# EAGLE schematic ME433 (EAGLE 9.3.0)
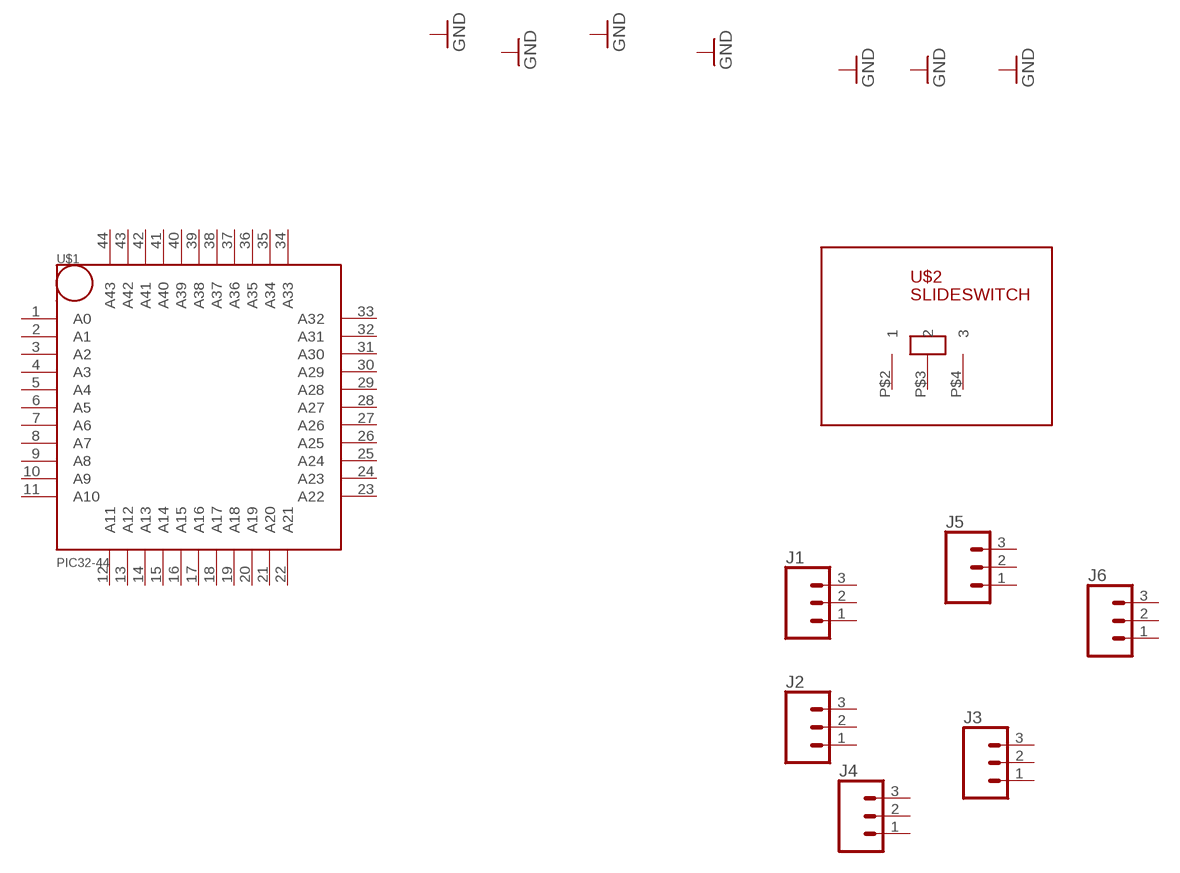
[diagram p0: schematic, sheet 1]

## Parts
J1  CONN_03  [1X03]
J2  CONN_03  [1X03]
J3  CONN_03  [1X03]
J4  CONN_03  [1X03]
J5  CONN_03  [1X03]
J6  CONN_03  [1X03]
U$1  PIC32-44  [TQFP44]
U$2  SLIDESWITCH  [SWITCH]
Unconnected: J1.1 J1.2 J1.3 J2.1 J2.2 J2.3 J3.1 J3.2 J3.3 J4.1 J4.2 J4.3 J5.1 J5.2 J5.3 J6.1 J6.2 J6.3 U$1.1(A0) U$1.2(A1) U$1.3(A2) U$1.4(A3) U$1.5(A4) U$1.6(A5) U$1.7(A6) U$1.8(A7) U$1.9(A8) U$1.10(A9) U$1.11(A10) U$1.12(A11) U$1.13(A12) U$1.14(A13) U$1.15(A14) U$1.16(A15) U$1.17(A16) U$1.18(A17) U$1.19(A18) U$1.20(A19) U$1.21(A20) U$1.22(A21) U$1.23(A22) U$1.24(A23) U$1.25(A24) U$1.26(A25) U$1.27(A26) U$1.28(A27) U$1.29(A28) U$1.30(A29) U$1.31(A30) U$1.32(A31) U$1.33(A32) U$1.34(A33) U$1.35(A34) U$1.36(A35) U$1.37(A36) U$1.38(A37) U$1.39(A38) U$1.40(A39) U$1.41(A40) U$1.42(A41) U$1.43(A42) U$1.44(A43) U$2.P$2 U$2.P$3 U$2.P$4

## Library data of the parts
J1-J6 = lib:CONN_03: Multi connection point. Often used as Generic Header-pin footprint for 0.1 inch spaced/style header connections On any of the 0.1 inch spaced packages, you can populate with these: Break Away Headers - Straight <https://www.sparkfun.com/products/116> (PRT-00116) Break Away Male Headers - Right Angle <https://www.sparkfun.com/products/553> (PRT-00553) Female Headers <https://www.sparkfun.com/products/115> (PRT-00115) Break Away Headers - Machine Pin <https://www.sparkfun.com/products/117> (PRT-00117) Break Away Female Headers - Swiss Machine Pin <https://www.sparkfun.com/products/743> (PRT-00743) Stackable Header - 3 Pin (Female, 0.1") <https://www.sparkfun.com/products/13875> (PRT-13875) For SCREWTERMINALS and SPRING TERMINALS visit here: Screw Terimnals on SparkFun.com <https://www.sparkfun.com/search/results?term=Screw+Terminals> (5mm/3.5mm/2.54mm spacing) This device is also useful as a general connection point to wire up your design to another part of your project. Our various solder wires solder well into these plated through hole pads. Hook-Up Wire - Assortment (Stranded, 22 AWG) <https://www.sparkfun.com/products/11375> (PRT-11375) Hook-Up Wire - Assortment (Solid Core, 22 AWG) <https://www.sparkfun.com/products/11367> (PRT-11367) View the entire wire category on our website here <https://www.sparkfun.com/categories/141> Special notes: Molex polarized connector foot print use with SKU : PRT-08232 with associated crimp pins and housings.
U$1 = lib:PIC32-44
U$2 = lib:SLIDESWITCH